# EAGLE design main (EAGLE 6.2)
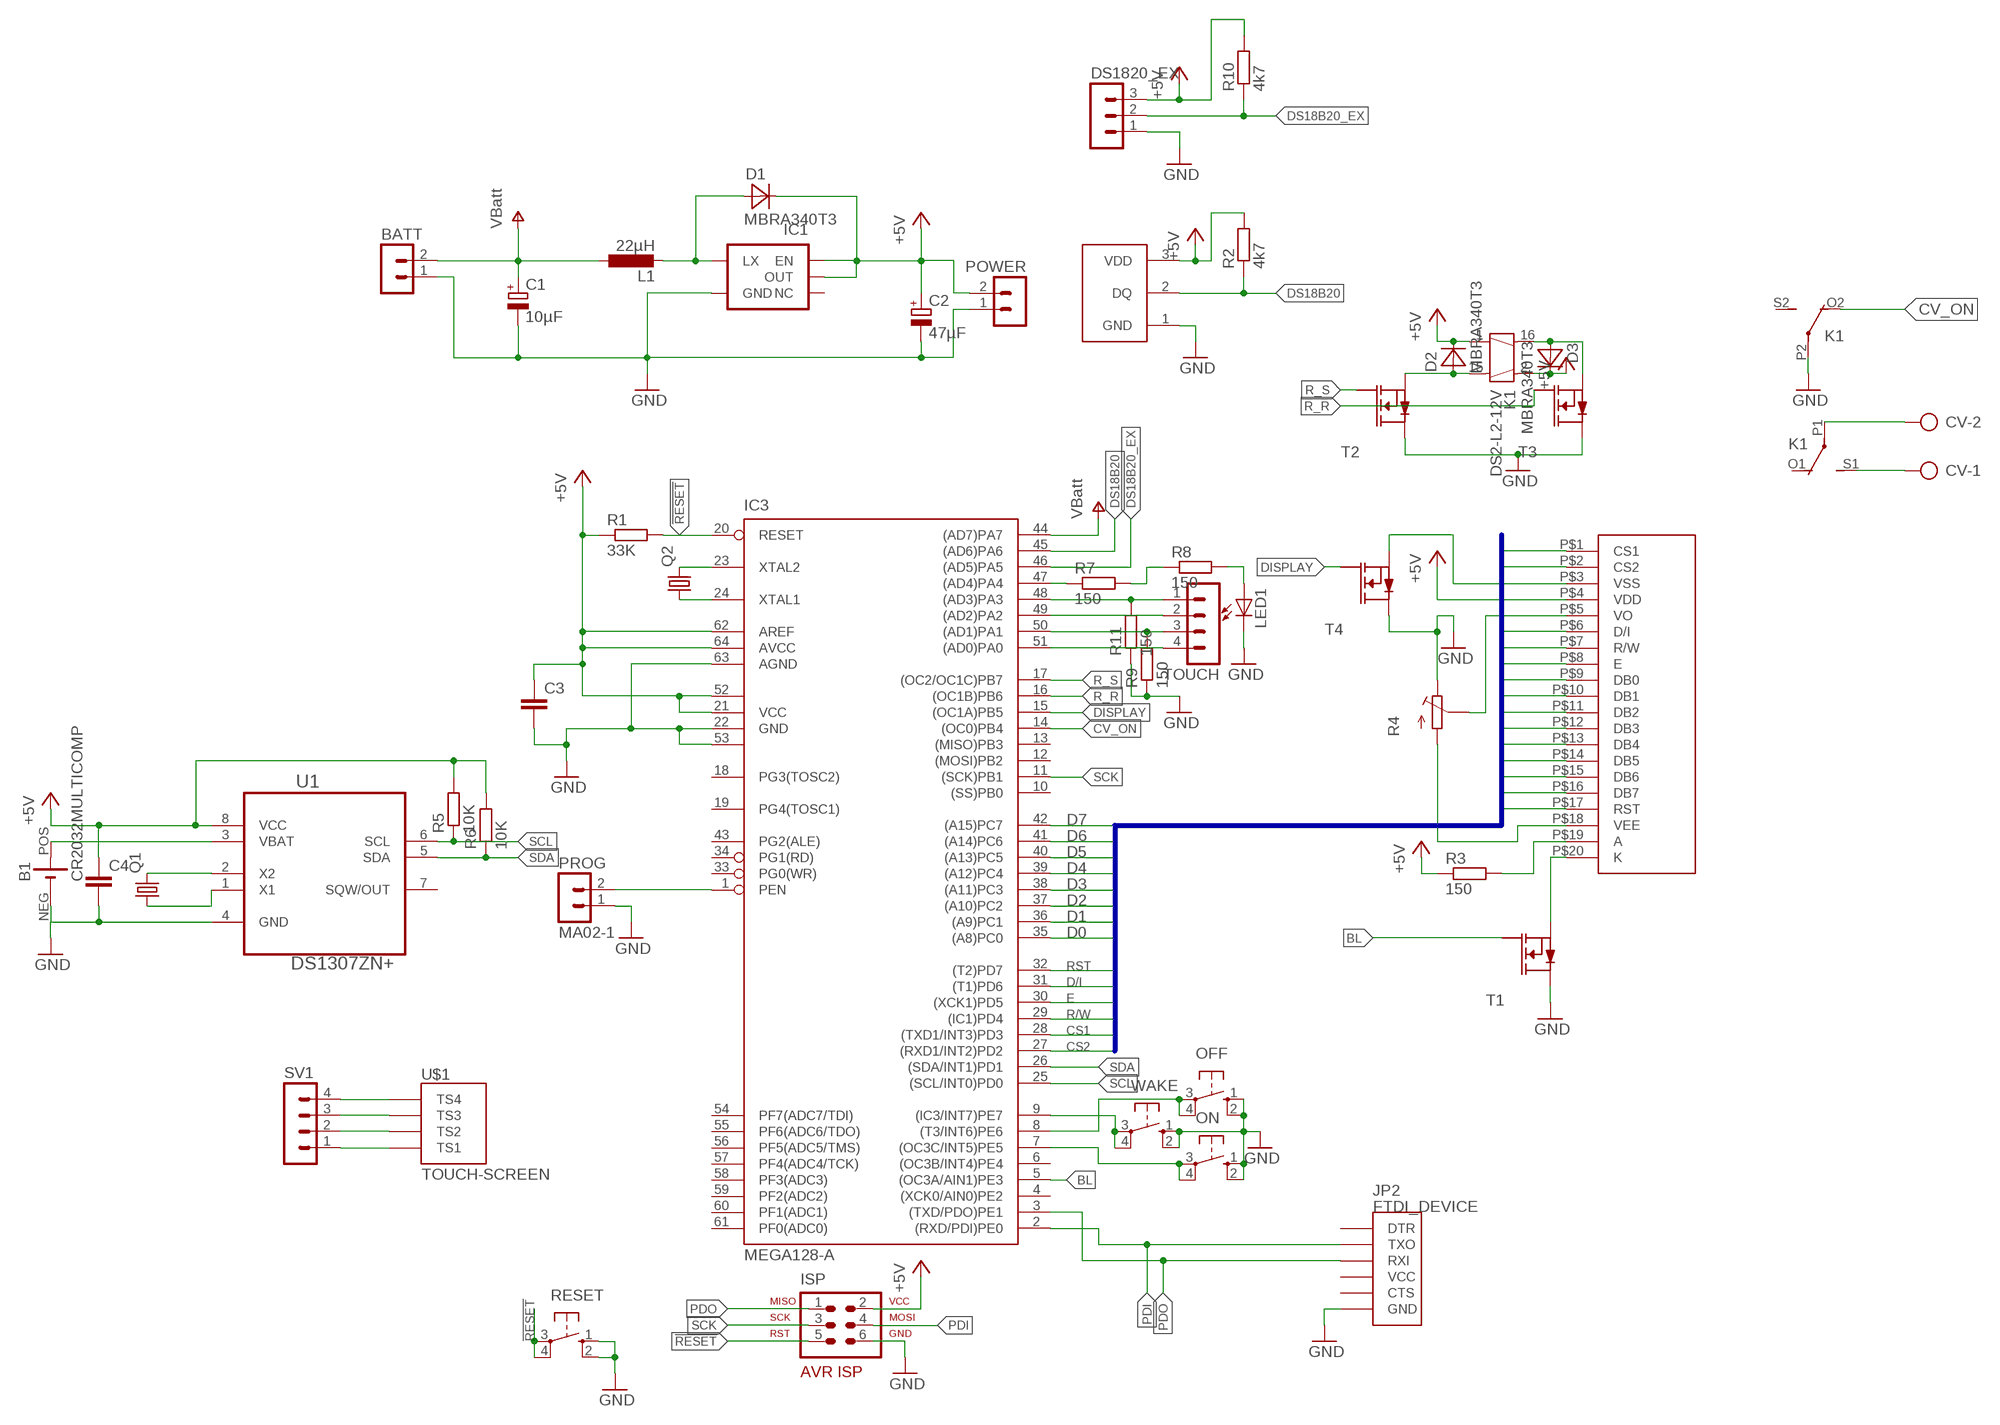
[diagram p0: schematic, sheet 1]

## Parts
B1  CR2032MULTICOMP  [CR2032]
BATT  MA02-1  [MA02-1]
C1  10µF  CPOL-EUD  [PANASONIC_D]
C2  47µF  CPOL-EUD  [PANASONIC_D]
C3  C-EUC0805  [C0805]
C4  C-EUC0805  [C0805]
CV  AK300/2  [AK300/2]
D1  MBRA340T3  [SMA]
D2  MBRA340T3  [SMA]
D3  MBRA340T3  [SMA]
DS1820  DS18B20  [TO92]
DS1820_EX  MA03-1  [MA03-1]
IC1  V_REG_NCP1400SOT23-5  [SOT23-5]
IC3  MEGA128-A  [TQFP64]
ISP  AVR-ISP-6HORZ  [AVR-ISP-6R]
JP2  FTDI_DEVICE  [FTDI_DEVICE_SIDE]
K1  DS2-L2-12V  [DS2E-L2]
L1  22µH  L-EUL2012C  [L2012C]
LED1  LEDSML1206  [SML1206]
OFF  10-XX  [B3F-10XX]
ON  10-XX  [B3F-10XX]
POWER  MA02-1  [MA02-1]
PROG  MA02-1  [MA02-1]
Q1  CRYSTALTC26V  [TC26V]
Q2  CRYSTALSM49  [SM49]
R1  33K  R-EU_R0805  [R0805]
R2  4k7  R-EU_R0805  [R0805]
R3  150  R-EU_R0805  [R0805]
R4  TRIM  [TRIM]
R5  10K  R-EU_R0805  [R0805]
R6  10K  R-EU_R0805  [R0805]
R7  150  R-EU_R0805  [R0805]
R8  150  R-EU_R0805  [R0805]
R9  150  R-EU_R0805  [R0805]
R10  4k7  R-EU_R0805  [R0805]
R11  150  R-EU_R0805  [R0805]
RESET  10-XX  [B3F-10XX]
SV1  MA04-1  [MA04-1]
T1  IRLML2502PBF  [SOT23]
T2  IRLML2502PBF  [SOT23]
T3  IRLML2502PBF  [SOT23]
T4  IRLML2502PBF  [SOT23]
TOUCH  MA04-1  [MA04-1]
U1  DS1307ZN+  [SOIC127P600X175-8N]
U$1  TOUCH-SCREEN  [TOUCH-SCREEN]
U$2  GLCD_LEDSEE  [GLCD_LEDSEE]
WAKE  10-XX  [B3F-10XX]

## Nets
!RESET: IC3.20(RESET) ISP.5 R1.2 RESET.3(P) RESET.4(P1)
+5V: C2.+ C3.1 C4.1 D1.C D2.C D3.C DS1820.3(VDD) DS1820_EX.3 IC1.1(EN) IC1.2(OUT) IC3.21(VCC) IC3.52(VCC1) IC3.62(AREF) IC3.64(AVCC) ISP.2 K1.1 K1.2 POWER.2 R1.1 R2.2 R3.1 R5.2 R6.2 R10.2 U1.8(VCC) U$2.P$4(VDD)
BL: IC3.5((OC3A/AIN1)PE3) T1.1(G)
CS1: IC3.28((TXD1/INT3)PD3) U$2.P$1(CS1)
CS2: IC3.27((RXD1/INT2)PD2) U$2.P$2(CS2)
CV_ON: IC3.14((OC0)PB4) K1.O2(3:O)
D0: IC3.35((A8)PC0) U$2.P$9(DB0)
D1: IC3.36((A9)PC1) U$2.P$10(DB1)
D2: IC3.37((A10)PC2) U$2.P$11(DB2)
D3: IC3.38((A11)PC3) U$2.P$12(DB3)
D4: IC3.39((A12)PC4) U$2.P$13(DB4)
D5: IC3.40((A13)PC5) U$2.P$14(DB5)
D6: IC3.41((A14)PC6) U$2.P$15(DB6)
D7: IC3.42((A15)PC7) U$2.P$16(DB7)
D/I: IC3.31((T1)PD6) U$2.P$6(D/I)
DISPLAY: IC3.15((OC1A)PB5) T4.1(G)
DS18B20: DS1820.2(DQ) IC3.45((AD6)PA6) R2.1
DS18B20_EX: DS1820_EX.2 IC3.46((AD5)PA5) R10.1
E: IC3.30((XCK1)PD5) U$2.P$8(E)
GND: B1.NEG(-) BATT.1 C1.- C2.- C3.2 C4.2 DS1820.1(GND) DS1820_EX.1 IC1.4(GND) IC3.22(GND) IC3.53(GND1) IC3.63(AGND) ISP.6 JP2.P$6(GND) K1.P2(3:P) LED1.C OFF.1(S) OFF.2(S1) ON.1(S) ON.2(S1) POWER.1 PROG.1 R4.1 R9.1 R11.1 RESET.1(S) RESET.2(S1) T1.3(D) T2.3(D) T3.3(D) T4.3(D) U1.4(GND) WAKE.1(S) WAKE.2(S1)
N$1: D1.A IC1.5(LX) L1.2
N$3: SV1.4 U$1.P$1(TS4)
N$4: SV1.3 U$1.P$2(TS3)
N$5: SV1.2 U$1.P$3(TS2)
N$6: SV1.1 U$1.P$4(TS1)
N$7: R3.2 U$2.P$19(A)
N$8: IC3.1(PEN) PROG.2
N$9: T1.2(S) U$2.P$20(K)
N$10: IC3.9((IC3/INT7)PE7) WAKE.3(P) WAKE.4(P1)
N$12: R4.3 U$2.P$18(VEE)
N$13: R4.2(T) U$2.P$5(VO)
N$14: D2.A K1.15 T2.2(S)
N$15: D3.A K1.16 T3.2(S)
N$16: IC3.8((T3/INT6)PE6) OFF.3(P) OFF.4(P1)
N$17: CV.2 K1.P1(2:P)
N$18: CV.1 K1.S1(2:S)
N$19: IC3.51((AD0)PA0) TOUCH.4
N$20: IC3.50((AD1)PA1) R9.2 TOUCH.3
N$21: IC3.49((AD2)PA2) TOUCH.2
N$22: IC3.48((AD3)PA3) R11.2 TOUCH.1
N$23: T4.2(S) U$2.P$3(VSS)
N$24: B1.POS(+) U1.3(VBAT)
N$26: Q1.1 U1.1(X1)
N$27: Q1.2 U1.2(X2)
N$28: IC3.7((OC3C/INT5)PE5) ON.3(P) ON.4(P1)
N$29: LED1.A R8.2
N$30: IC3.47((AD4)PA4) R7.1
N$31: R7.2 R8.1
N$33: IC3.23(XTAL2) Q2.2
N$34: IC3.24(XTAL1) Q2.1
PDI: IC3.2((RXD/PDI)PE0) ISP.4 JP2.P$2(TXO)
PDO: IC3.3((TXD/PDO)PE1) ISP.1 JP2.P$3(RXI)
R/W: IC3.29((IC1)PD4) U$2.P$7(R/W)
R_R: IC3.16((OC1B)PB6) T3.1(G)
R_S: IC3.17((OC2/OC1C)PB7) T2.1(G)
RST: IC3.32((T2)PD7) U$2.P$17(RST)
SCK: IC3.11((SCK)PB1) ISP.3
SCL: IC3.25((SCL/INT0)PD0) R5.1 U1.6(SCL)
SDA: IC3.26((SDA/INT1)PD1) R6.1 U1.5(SDA)
V+: BATT.2 C1.+ IC3.44((AD7)PA7) L1.1 ; supply symbol labelled VBatt
Unconnected: IC1.3(NC) IC3.4((XCK0/AIN0)PE2) IC3.6((OC3B/INT4)PE4) IC3.10((SS)PB0) IC3.12((MOSI)PB2) IC3.13((MISO)PB3) IC3.18(PG3(TOSC2)) IC3.19(PG4(TOSC1)) IC3.33(PG0(WR)) IC3.34(PG1(RD)) IC3.43(PG2(ALE)) IC3.54(PF7(ADC7/TDI)) IC3.55(PF6(ADC6/TDO)) IC3.56(PF5(ADC5/TMS)) IC3.57(PF4(ADC4/TCK)) IC3.58(PF3(ADC3)) IC3.59(PF2(ADC2)) IC3.60(PF1(ADC1)) IC3.61(PF0(ADC0)) JP2.P$1(DTR) JP2.P$4(VCC) JP2.P$5(CTS) K1.O1(2:O) K1.S2(3:S) U1.7(SQW/OUT)

## Buses
D[0..7],RST,D/I,E,R/W,CS1,CS2

## Library data of the parts
B1 = custom:CR2032; OC_FARNELL: 2064725
BATT POWER PROG = con-lstb:MA02-1
C1 C2 = rcl:CPOL-EU: POLARIZED CAPACITOR, European symbol
C3 C4 = rcl:C-EU: CAPACITOR, European symbol
CV = con-ptr500:AK300/2: CONNECTOR; OC_FARNELL: unknown; OC_NEWARK: unknown
D1-D3 = diode:MBRA340T3: Surface Mount Schottky Power Rectifier Source: http://www.onsemi.com/pub_link/Collateral/MBRA340T3-D.PDF
DS1820 = joep-custom:DS18B20
DS1820_EX = con-lstb:MA03-1: PIN HEADER; OC_FARNELL: unknown; OC_NEWARK: unknown
IC1 = SparkFun-PowerIC:V_REG_NCP1400: Switching step-up voltage regulator NCP1400 switiching regulator takes single cell AA and outputs 100mA at 3.3V or 5V with minimal number of external components.
IC3 = avr-7:MEGA128: MICROCONTROLLER 128 Kbytes FLASH 4 Kbytes SRAM 4 Kbytes EEPROM DUAL USART 8-channel 10 bit ADC
ISP = avr-7:AVR-ISP-6: AVR ISP-6 Serial Programming Header
JP2 = SparkFun-Connectors:FTDI_DEVICE: Connector which mates to FTDI basic or FTDI cable.
K1 = relay:DS2-L2-*: RELAY NAiS bistable, 2 x switch, 4 A/250 V; OC_FARNELL: unknown; OC_NEWARK: unknown
L1 = rcl:L-EU: INDUCTOR, European symbol
LED1 = led:LED: LED OSRAM: - CHIPLED LG R971, LG N971, LY N971, LG Q971, LY Q971, LO R971, LY R971 LH N974, LH R974 LS Q976, LO Q976, LY Q976 LO Q996 - Hyper CHIPLED LW Q18S LB Q993, LB Q99A, LB R99A - SideLED LS A670, LO A670, LY A670, LG A670, LP A670 LB A673, LV A673, LT A673, LW A673 LH A674 LY A675 LS A676, LA A676, LO A676, LY A676, LW A676 LS A679, LY A679, LG A679 - Hyper Micro SIDELED® LS Y876, LA Y876, LO Y876, LY Y876 LT Y87S - SmartLED LW L88C, LW L88S LB L89C, LB L89S, LG L890 LS L89K, LO L89K, LY L89K LS L896, LA L896, LO L896, LY L896 - TOPLED LS T670, LO T670, LY T670, LG T670, LP T670 LSG T670, LSP T670, LSY T670, LOP T670, LYG T670 LG T671, LOG T671, LSG T671 LB T673, LV T673, LT T673, LW T673 LH T674 LS T676, LA T676, LO T676, LY T676, LB T676, LH T676, LSB T676, LW T676 LB T67C, LV T67C, LT T67C, LS T67K, LO T67K, LY T67K, LW E67C LS E67B, LA E67B, LO E67B, LY E67B, LB E67C, LV E67C, LT E67C LW T67C LS T679, LY T679, LG T679 LS T770, LO T770, LY T770, LG T770, LP T770 LB T773, LV T773, LT T773, LW T773 LH T774 LS E675, LA E675, LY E675, LS T675 LS T776, LA T776, LO T776, LY T776, LB T776 LHGB T686 LT T68C, LB T68C - Hyper Mini TOPLED® LB M676 - Mini TOPLED Santana® LG M470 LS M47K, LO M47K, LY M47K Source: http://www.osram.convergy.de LUXEON: - LUMILED® LXK2-PW12-R00, LXK2-PW12-S00, LXK2-PW14-U00, LXK2-PW14-V00 LXK2-PM12-R00, LXK2-PM12-S00, LXK2-PM14-U00 LXK2-PE12-Q00, LXK2-PE12-R00, LXK2-PE12-S00, LXK2-PE14-T00, LXK2-PE14-U00 LXK2-PB12-K00, LXK2-PB12-L00, LXK2-PB12-M00, LXK2-PB14-N00, LXK2-PB14-P00, LXK2-PB14-Q00 LXK2-PR12-L00, LXK2-PR12-M00, LXK2-PR14-Q00, LXK2-PR14-R00 LXK2-PD12-Q00, LXK2-PD12-R00, LXK2-PD12-S00 LXK2-PH12-R00, LXK2-PH12-S00 LXK2-PL12-P00, LXK2-PL12-Q00, LXK2-PL12-R00 Source: www.luxeon.com KINGBRIGHT: KA-3528ASYC Source: www.kingbright.com
OFF ON RESET WAKE = switch-omron:10-XX: OMRON SWITCH; MPN: B3F-1000; OC_FARNELL: 176432; OC_NEWARK: 36M3542
Q1 Q2 = crystal:CRYSTAL: CRYSTAL; OC_FARNELL: unknown; OC_NEWARK: unknown
R1-R3 R5-R11 = rcl:R-EU_: RESISTOR, European symbol
R4 = custom:TRIM
SV1 TOUCH = con-lstb:MA04-1: PIN HEADER; OC_FARNELL: unknown; OC_NEWARK: unknown
T1-T4 = custom:IRLML2502PBF; OC_FARNELL: 9102981
U1 = custom:DS1307ZN+: 64 x 8, Serial, I2C Real-Time Clock; MPN: DS1307ZN+; OC_FARNELL: 9725253; OC_NEWARK: 73J0081; PACKAGE: SOIC-8; SUPPLIER: Maxim
U$1 = SparkFun-Connectors:TOUCH-SCREEN: Nintendo DS touch screen connector LCD-09105
U$2 = SparkFun-Displays:GLCD_LEDSEE

## Board
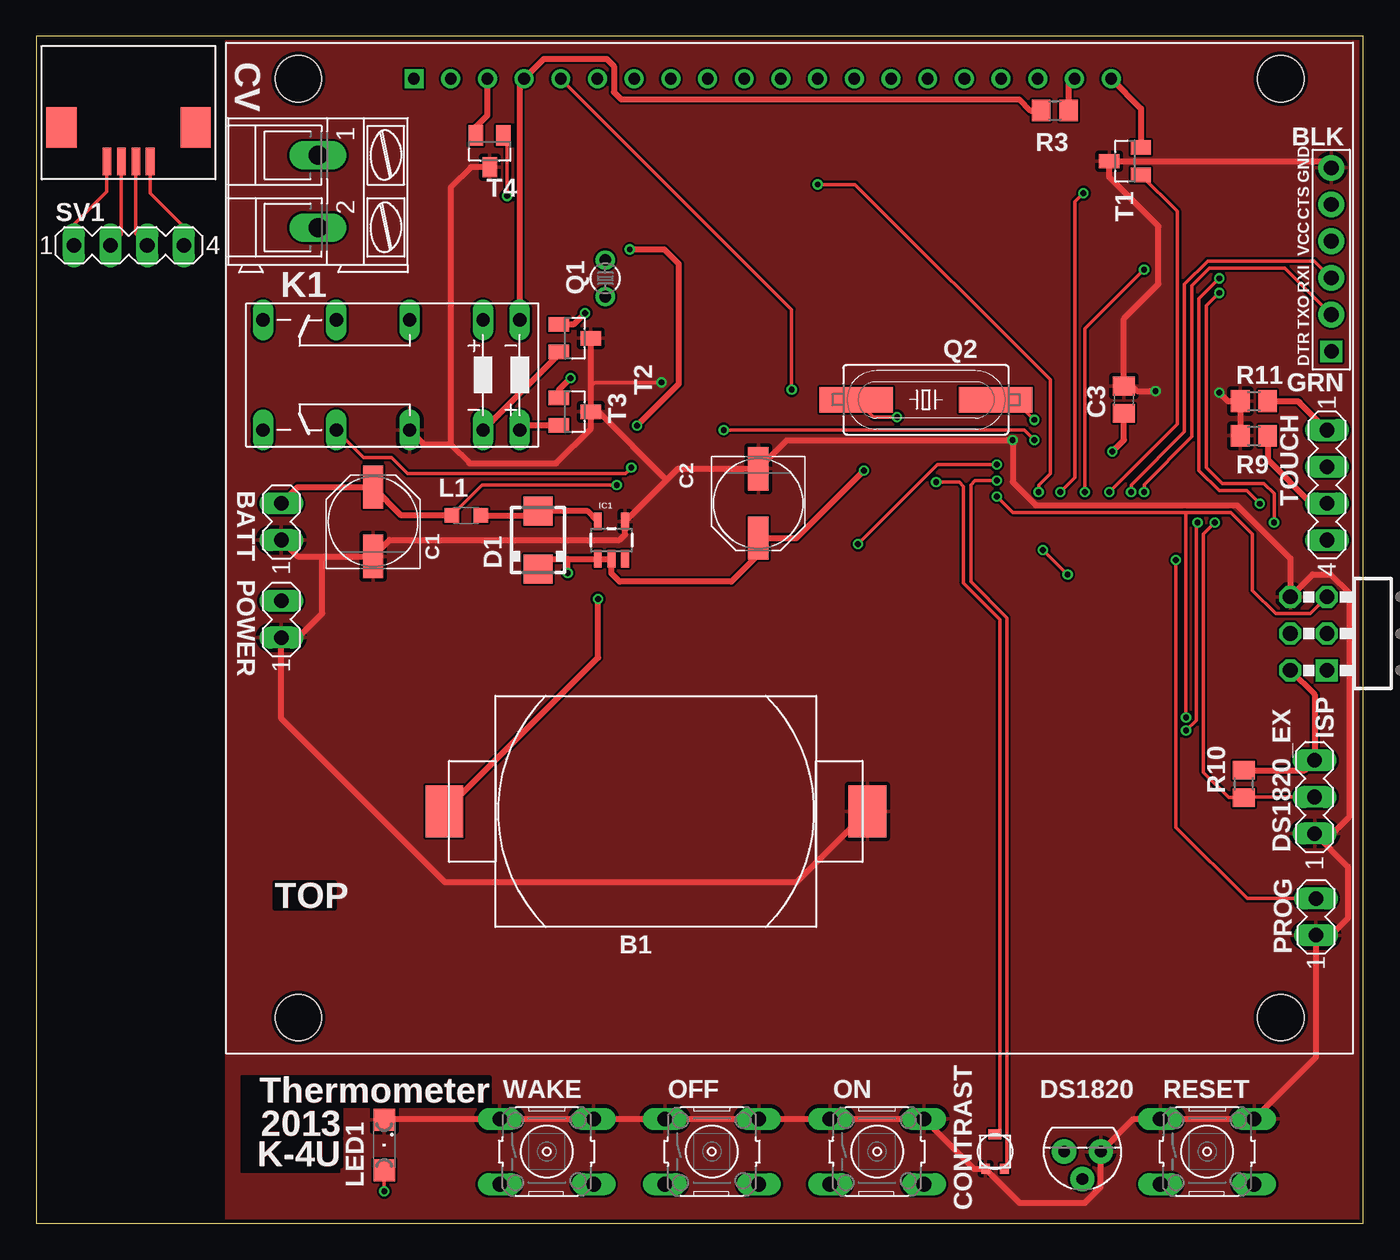
[diagram p1: board, top side]
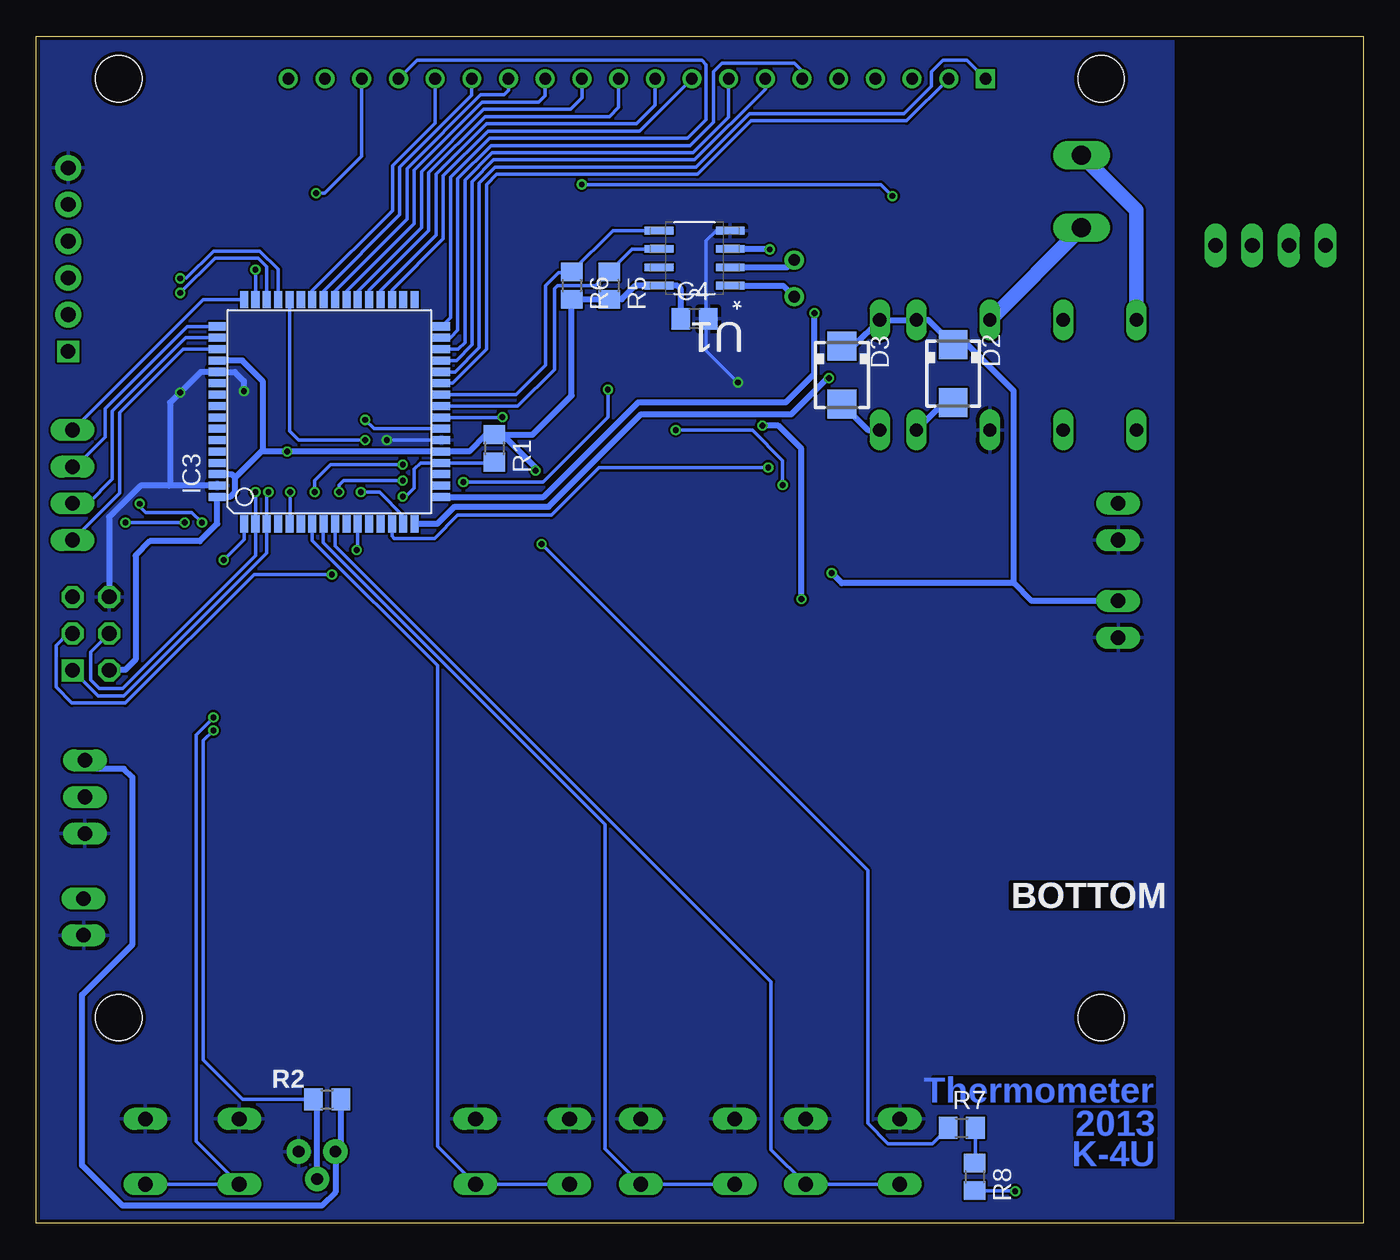
[diagram p2: board, bottom side, seen from below]

Size 91.88 x 82.2 mm. Coordinates in mm from the lower left corner, seen from the top.
Outline: 0,0 91.88,0 91.88,82.2 0,82.2 0,0
Copper layers (1*16): Top 0.035mm / dielectric 1.5mm / Bottom 0.035mm
Design rules: minimum track width 6mil, minimum drill 12mil, track to track 6mil, track to pad 6mil, pad to pad 6mil, via to via 6mil, smd to smd 0mil, copper to edge 10mil, drill to drill 10mil, minimum pad ring 10mil, minimum via ring 6mil, stop-mask expansion 2mil, vias tented up to drill 100mil, thermal gap 10mil

### Footprints (pad centres in the part's own frame; a part is rotated, then mirrored left to right if it is on the bottom)
CR2032 = smd 2.6 x 3.6: NEG -14.65,0; POS 14.65,0
MA02-1 = drill 1.016 long: 1 -1.27,0; 2 1.27,0
PANASONIC_D = smd 3 x 1.4: + 2.4,0; - -2.4,0
C0805 = smd 1.3 x 1.5: 1 -0.95,0; 2 0.95,0
AK300/2 = drill 1.321 long: 1 -2.515,0; 2 2.489,0
SMA = smd 2 x 2: A 2,0; C -2,0
TO92 = drill 0.813 pad 1.676: 1 -1.27,0; 2 0,1.905; 3 1.27,0
MA03-1 = drill 1.016 long: 1 -2.54,0; 2 0,0; 3 2.54,0
SOT23-5 = smd 0.55 x 1.2: 1 -0.95,-1.3; 2 0,-1.3; 3 0.95,-1.3; 4 0.95,1.3; 5 -0.95,1.3
TQFP64 = smd 1.194 x 0.559: 1 -7.76,5.905; 2 -7.76,5.118; 3 -7.76,4.331; 4 -7.76,3.543; 5 -7.76,2.756; 6 -7.76,1.968; 7 -7.76,1.181; 8 -7.76,0.394; 9 -7.76,-0.394; 10 -7.76,-1.181; 11 -7.76,-1.968; 12 -7.76,-2.756; 13 -7.76,-3.543; 14 -7.76,-4.331; 15 -7.76,-5.118; 16 -7.76,-5.905; 33 7.76,-5.905; 34 7.76,-5.118; 35 7.76,-4.331; 36 7.76,-3.543; 37 7.76,-2.756; 38 7.76,-1.968; 39 7.76,-1.181; 40 7.76,-0.394; 41 7.76,0.394; 42 7.76,1.181; 43 7.76,1.968; 44 7.76,2.756; 45 7.76,3.543; 46 7.76,4.331; 47 7.76,5.118; 48 7.76,5.905 | smd 0.559 x 1.194: 17 -5.905,-7.76; 18 -5.118,-7.76; 19 -4.331,-7.76; 20 -3.543,-7.76; 21 -2.756,-7.76; 22 -1.968,-7.76; 23 -1.181,-7.76; 24 -0.394,-7.76; 25 0.394,-7.76; 26 1.181,-7.76; 27 1.968,-7.76; 28 2.756,-7.76; 29 3.543,-7.76; 30 4.331,-7.76; 31 5.118,-7.76; 32 5.905,-7.76; 49 5.905,7.76; 50 5.118,7.76; 51 4.331,7.76; 52 3.543,7.76; 53 2.756,7.76; 54 1.968,7.76; 55 1.181,7.76; 56 0.394,7.76; 57 -0.394,7.76; 58 -1.181,7.76; 59 -1.968,7.76; 60 -2.756,7.76; 61 -3.543,7.76; 62 -4.331,7.76; 63 -5.118,7.76; 64 -5.905,7.76
AVR-ISP-6R = drill 1.016 square: 1 -2.54,-1.27 | drill 1.016 octagon: 2 -2.54,1.27; 3 0,-1.27; 4 0,1.27; 5 2.54,-1.27; 6 2.54,1.27
FTDI_DEVICE_SIDE = drill 1 square: P$1 -6.35,0 | drill 1.016 pad 1.778: P$2 -3.81,0; P$3 -1.27,0; P$4 1.27,0; P$5 3.81,0; P$6 6.35,0
DS2E-L2 = drill 0.914 long: 1 -7.62,-3.81; 2 -5.08,-3.81; 15 -5.08,3.81; 16 -7.62,3.81; O1 5.08,-3.81; O2 5.08,3.81; P1 0,-3.81; P2 0,3.81; S1 10.16,-3.81; S2 10.16,3.81
L2012C = smd 1 x 1: 1 -1,0; 2 1,0
SML1206 = smd 1.5 x 1.5: A 1.75,0; C -1.75,0
B3F-10XX = drill 1.016 long: 1 -3.251,2.261; 2 3.251,2.261; 3 -3.251,-2.261; 4 3.251,-2.261
TC26V = drill 0.813: 1 -1.27,0; 2 1.27,0
SM49 = smd 5.08 x 1.778: 1 -4.826,0; 2 4.826,0
R0805 = smd 1.3 x 1.5: 1 -0.95,0; 2 0.95,0
TRIM = smd 0.6 x 0.7: 1 -0.65,-1.2; 3 0.65,-1.2 | smd 0.9 x 0.7: 2 0,1.2
MA04-1 = drill 1.016 long: 1 -3.81,0; 2 -1.27,0; 3 1.27,0; 4 3.81,0
SOT23 = smd 1 x 1.4: 1 -0.95,-1.1; 2 0.95,-1.1; 3 0,1.1
SOIC127P600X175-8N = smd 1.981 x 0.533: 1 -2.464,1.905; 2 -2.464,0.635; 3 -2.464,-0.635; 4 -2.464,-1.905; 5 2.464,-1.905; 6 2.464,-0.635; 7 2.464,0.635; 8 2.464,1.905
TOUCH-SCREEN = smd 0.6 x 1.9: P$1 0,0; P$2 1,0; P$3 2,0; P$4 3,0 | smd 2.1 x 2.8: P$5 -3.15,-2.35; P$6 6.15,-2.35
GLCD_LEDSEE = drill 0.8 square: P$1 13,67.5 | drill 0.8: P$2 15.54,67.5; P$3 18.08,67.5; P$4 20.62,67.5; P$5 23.16,67.5; P$6 25.7,67.5; P$7 28.24,67.5; P$8 30.78,67.5; P$9 33.32,67.5; P$10 35.86,67.5; P$11 38.4,67.5; P$12 40.94,67.5; P$13 43.48,67.5; P$14 46.02,67.5; P$15 48.56,67.5; P$16 51.1,67.5; P$17 53.64,67.5; P$18 56.18,67.5; P$19 58.72,67.5; P$20 61.26,67.5 | hole 3.2: 5,67.5; 73,67.5; 73,2.5; 5,2.5

### Placement (x,y rotation side)
B1  42.9,28.53 180 top
BATT  16.97,48.58 90 top
C1  23.32,48.58 90 top
C2  49.99,49.85 270 top
C3  75.3,57.03 90 top
C4  46.3,62.63 0 bottom
CV  19.51,71.44 270 top
D1  34.75,47.31 90 top
D2  28.4,58.83 270 bottom
D3  36.1,58.73 270 bottom
DS1820  72.43,4.98 180 top
DS1820_EX  88.5,29.53 90 top
IC1  39.83,47.31 0 top
IC3  71.58,56.2 90 bottom
ISP  88.09,40.84 90 top
JP2  89.66,66.73 90 top
K1  25.86,58.74 180 top
L1  29.77,49.02 0 top
LED1  24.1,5.43 270 top
OFF  46.78,4.98 0 top
ON  58.21,4.98 0 top
POWER  16.97,41.83 90 top
PROG  88.6,21.23 90 top
Q1  39.4,65.43 90 top
Q2  61.6,57.03 0 top
R1  60.15,53.66 270 bottom
R2  71.73,8.6 0 bottom
R3  70.52,77.05 0 top
R4  66.38,4.98 0 top
R5  52.2,64.93 270 bottom
R6  54.8,64.93 270 bottom
R7  27.8,6.63 0 bottom
R8  26.9,3.23 270 bottom
R9  84.3,54.53 0 top
R10  83.6,30.43 90 top
R11  84.3,56.93 0 top
RESET  81.07,4.98 0 top
SV1  6.42,67.72 0 top
T1  75.38,73.54 90 top
T2  37.29,61.28 270 top
T3  37.29,56.2 270 top
T4  31.4,74.23 180 top
TOUCH  89.36,51.12 270 top
U1  46.3,66.83 180 bottom
U$1  7.9,73.53 180 top
U$2  13.16,11.75 0 top
WAKE  35.35,4.98 0 top

### Tracks (layer width: path | path; a pad name or v marks a point on that pad's centre or on a via)
!RESET  (via drill 0.4)
  Top 0.254: ISP.5 88.21,42.23 85.8,42.23 84.2,43.83 84.2,47.73 82.7,49.23 79.5,49.23 | 79.5,49.23 67.6,49.23 v66.5,50.33 | v79.6,35.03 79.6,49.13 79.5,49.23
  Bottom 0.254: R1.2 60.2,52.66 IC3.20 65.27,52.66 65.7,52.23 65.7,50.93 66.3,50.33 v66.5,50.33 | RESET.4 RESET.3 80.8,5.7 80.8,33.83 v79.6,35.03
+5V  (via drill 0.4)
  Top 0.406: D1.C 35.45,46.01 36.8,46.01 | 36.8,46.01 IC1.1 IC1.2 39.83,45 40.4,44.43 48.12,44.43 49.99,46.3 C2.+ 52.62,47.45 v57.3,52.13 | K1.1 33.48,78.95 U$2.P$4 35.16,80.63 39.5,80.63 40,80.13 40,78.33 40.5,77.83 68.05,77.83 68.83,77.05 R3.1 | v74.5,53.44 75.3,54.24 C3.1 | ISP.2 88.5,36.62 DS1820_EX.3 87.81,31.38 R10.2 | v36.8,45.03 36.8,46.01
  Bottom 0.254: 79.3,50.33 IC3.64
  Bottom 0.406: R1.1 59.58,54.61 57.3,52.33 v57.3,52.13 | R1.1 60.72,54.61 61.89,53.44 IC3.21 v74.5,53.44 76.2,53.44 | 76.2,53.44 76.29,53.44 78.1,51.63 | IC3.62 78.34,51.87 78.1,51.63 | 79.3,50.33 78.4,50.33 78.1,50.63 78.1,51.63 | IC3.64 79.34,48.44 80.55,47.23 84,47.23 85,46.23 85,39.03 85.7,38.33 86.79,38.33 ISP.2 | 76.2,53.44 76.2,58.33 77.61,59.74 IC3.52 | R1.1 57.52,54.61 54.8,57.33 R6.2 R5.2 51.35,63.98 50.41,64.92 U1.8 47.49,64.92 47.25,64.68 C4.1 | D3.C 35.3,60.73 K1.1 K1.2 30.12,62.55 D2.C 27.4,60.83 24.2,57.63 24.2,44.33 | R2.2 70.78,5.36 DS1820.3 71.16,2.17 72.1,1.23 85.9,1.23 88.7,4.03 88.7,15.83 85.2,19.33 85.2,30.88 85.8,31.48 87.91,31.48 DS1820_EX.3 | POWER.2 22.97,43.1 24.2,44.33 | 24.2,44.33 36.1,44.33 v36.8,45.03
BL  (via drill 0.4)
  Top 0.254: T1.1 79,70.07 79,55.33 v74.3,50.63
  Bottom 0.254: v74.3,50.63 74.3,48.48 IC3.5
CS1
  Bottom 0.254: U$2.P$1 27.44,80.53 29.1,80.53 29.9,79.73 29.9,78.73 31.8,76.83 42.5,76.83 46.2,73.13 60.1,73.13 61.2,72.03 61.2,60.63 62.87,58.96 IC3.28
CS2
  Bottom 0.254: IC3.27 63.06,58.17 60.7,60.53 60.7,71.93 60,72.63 46.1,72.63 42.4,76.33 31.62,76.33 U$2.P$2
CV_ON  (via drill 0.4)
  Top 0.254: v41.2,52.33 40.8,51.93 25.7,51.93 24.6,53.03 22.68,53.03 K1.O2
  Bottom 0.254: IC3.14 67.25,47.58 67.1,47.43 64.3,47.43 62.7,49.03 56.2,49.03 52.9,52.33 v41.2,52.33
D0
  Bottom 0.254: IC3.35 67.25,64.63 63.7,68.18 63.7,72.53 60.6,75.63 50.1,75.63 U$2.P$9
D1
  Bottom 0.254: U$2.P$10 49.02,77.41 50.3,76.13 60.7,76.13 64.2,72.63 64.2,68.43 68.04,64.59 IC3.36
D2
  Bottom 0.254: U$2.P$11 51.56,77.27 52.2,76.63 60.8,76.63 64.7,72.73 64.7,68.73 68.82,64.61 IC3.37
D3
  Bottom 0.254: U$2.P$12 54.1,77.93 54.9,77.13 60.9,77.13 65.2,72.83 65.2,68.93 69.61,64.52 IC3.38 69.61,64.42
D4
  Bottom 0.254: U$2.P$13 56.64,78.09 57.1,77.63 61,77.63 65.7,72.93 65.7,69.23 70.4,64.53 IC3.39
D5
  Bottom 0.254: U$2.P$14 59.18,78.45 59.5,78.13 61.1,78.13 66.2,73.03 66.2,69.53 71.19,64.54 IC3.40
D6
  Bottom 0.254: 61.72,78.81 U$2.P$15 61.72,78.11 66.7,73.13 66.7,69.83 71.97,64.56 IC3.41
D7
  Bottom 0.254: U$2.P$16 64.26,76.17 67.2,73.23 67.2,70.13 72.76,64.57 IC3.42
D/I
  Bottom 0.254: IC3.31 63.2,61.32 63.2,61.33 62.7,61.83 62.7,72.33 60.4,74.63 46.6,74.63 45,76.23 45,79.73 44.4,80.33 39.4,80.33 38.86,79.79 U$2.P$6
DISPLAY  (via drill 0.4)
  Top 0.254: v69.4,50.63 69.4,51.13 70.2,51.93 70.2,58.43 56.7,71.93 v54.1,71.93 | T4.1 32.6,75.08 v32.6,71.13
  Bottom 0.254: v54.1,71.93 33.4,71.93 v32.6,71.13 | IC3.15 66.46,48.99 68.1,50.63 v69.4,50.63
DS18B20  (via drill 0.4)
  Top 0.254: v80.4,48.53 80.3,48.43 80.3,34.83 v79.6,34.13 | v84.7,49.83 83.8,50.73 81.9,50.73 80.5,52.13 80.5,64.03 v81.9,65.43
  Bottom 0.254: IC3.45 75.12,66.05 76.4,67.33 79.6,67.33 81.5,65.43 v81.9,65.43 | v80.4,48.53 81.1,49.23 84.3,49.23 84.7,49.63 v84.7,49.83 | R2.1 77.57,8.6 80.3,11.33 80.3,33.43 v79.6,34.13
  Bottom 0.406: DS1820.2 72.43,8.35 R2.1
DS18B20_EX  (via drill 0.4)
  Top 0.254: v81.6,48.53 80.8,47.73 80.8,31.23 82.55,29.48 R10.1 83.65,29.53 DS1820_EX.2 | v81.9,64.43 81,63.53 81,52.33 82.1,51.23 85,51.23 85.7,50.53 v85.7,48.53
  Bottom 0.254: IC3.46 75.91,66.24 76.5,66.83 79.5,66.83 v81.9,64.43 | v81.6,48.53 v85.7,48.53
E
  Bottom 0.254: IC3.30 62.66,60.53 62.2,60.99 62.2,72.23 60.3,74.13 46.4,74.13 43.94,76.59 U$2.P$8
GND  (via drill 0.4)
  Top 0.254: v43.3,58.23 38.69,58.23 38.39,57.93 | C3.2 75.85,57.98
  Top 0.406: BATT.1 18.1,46.18 20,46.18 | 20,46.18 C1.- 24.47,47.33 40.4,47.33 40.78,47.71 IC1.4 43.65,51.48 | T2.3 38.39,57.93 T3.3 38.93,56.2 43.65,51.48 | 28.7,53.93 30,52.63 36,52.63 38.4,55.03 38.4,56.23 | 50.1,52.23 50.1,53.29 | 75.85,57.98 76.2,57.63 v77.5,57.63 | LED1.C 24.16,7.24 WAKE.1 WAKE.2 OFF.1 OFF.2 ON.1 ON.2 64.92,3.78 R4.1 68.08,1.43 72.6,1.43 73.7,2.53 DS1820.1 75.96,7.24 RESET.1 RESET.2 88.6,11.52 PROG.1 89.63,19.96 90.8,21.13 90.8,24.69 DS1820_EX.1 88.54,27.03 89.8,27.03 90.9,28.13 90.9,43.63 89.6,44.93 88.37,44.93 ISP.6 86.82,46.04 83.13,49.73 69.2,49.73 67.6,51.33 v67.6,54.23 51.97,54.23 C2.- 44.42,52.25 43.65,51.48 | 20,46.18 19.8,45.98 19.8,42.23 18.13,40.56 POWER.1 16.97,34.96 28.3,23.63 52.65,23.63 B1.NEG | T1.3 89.2,73.54 JP2.P$6 | T4.3 30.1,73.13 28.7,71.73 28.7,53.93 | T1.3 | C3.2 75.3,62.63 77.7,65.03 77.7,69.03 74.28,72.45 T1.3 | 28.7,53.93 26.86,53.93 K1.P2 | v81.9,57.53 82.5,56.93 R11.1 R9.1
  Bottom 0.254: IC3.22 v67.6,54.23 | U1.4 44.8,68.73 45.5,68.03 45.5,62.48 | v43.3,58.23 45.5,60.43 45.5,62.48 | 45.5,62.48 C4.2
  Bottom 0.406: v77.5,57.63 77.5,58.33 78.13,58.96 IC3.53 80.47,58.96 v81.9,57.53 82.6,56.83 82.6,51.18 82.7,51.08 | ISP.6 86.82,48.91 84.65,51.08 82.7,51.08 | IC3.63 82.7,51.08
  pour Top: 91.8,0 13.2,0 13.2,82.2 91.8,82.2
  pour Bottom: 91.8,0 13.2,0 13.2,82.2 91.8,82.2
N$1
  Top 0.406: IC1.5 38.18,49.31 D1.A 34.46,49.02 L1.2
N$3
  Top 0.254: U$1.P$1 7.9,71.33 10.23,69 SV1.4
N$4
  Top 0.254: U$1.P$2 6.9,68.51 SV1.3
N$5
  Top 0.254: SV1.2 5.9,68.47 U$1.P$3
N$6
  Top 0.254: SV1.1 2.61,69.14 4.9,71.43 U$1.P$4
N$7
  Top 0.406: U$2.P$19 71.47,78.84 R3.2
N$8  (via drill 0.4)
  Top 0.254: PROG.2 83.83,22.5 78.9,27.43 v78.9,45.93
  Bottom 0.254: IC3.1 77.49,47.34 v78.9,45.93
N$9
  Top 0.406: U$2.P$20 76.48,77.19 T1.2
N$10
  Bottom 0.254: WAKE.3 WAKE.4 41,5.12 41,16.73 71.19,46.92 IC3.9
N$12  (via drill 0.4)
  Top 0.254: v66.5,51.43 65,51.43 64.7,51.13 64.7,44.43 67.2,41.93 67.2,3.95 R4.3 | v72.5,71.33 71.9,70.73 71.9,51.63 v70.9,50.63
  Bottom 0.254: v66.5,51.43 70.6,51.43 70.9,51.13 v70.9,50.63 | U$2.P$18 69.34,73.89 71.9,71.33 v72.5,71.33
N$13  (via drill 0.4)
  Top 0.254: U$2.P$5 52.3,63.27 v52.3,57.73 | R4.2 66.7,6.5 66.7,41.83 64.2,44.33 64.2,51.03 63.9,51.33 v62.3,51.33
  Bottom 0.254: v62.3,51.33 56.8,51.33 52.3,55.83 v52.3,57.73
N$14
  Top 0.406: T2.2 36.19,60.18 K1.15
  Bottom 0.406: D2.A 29.04,56.83 K1.15
N$15
  Top 0.406: T3.2 33.8,55.25 K1.16
  Bottom 0.406: D3.A 34.3,54.93 K1.16
N$16
  Bottom 0.254: OFF.3 OFF.4 52.5,5.19 52.5,27.63 72,47.13 72,48.41 IC3.8
N$17
  Bottom 1.016: CV.2 19.51,68.9 K1.P1
N$18
  Bottom 1.016: CV.1 15.7,70.14 K1.S1
N$19
  Bottom 0.254: IC3.51 81.7,60.53 86.1,56.13 86.1,50.57 TOUCH.4
N$20
  Top 0.406: TOUCH.3 88.28,49.85 85.25,52.88 R9.2
  Bottom 0.254: IC3.50 81.51,61.32 86.6,56.23 86.6,51.53 88.28,49.85 TOUCH.3
N$21
  Bottom 0.254: IC3.49 81.42,62.11 87.1,56.43 87.1,54.43 89.14,52.39 TOUCH.2
N$22
  Top 0.406: TOUCH.1 87.48,56.81 87.36,56.93 R11.2
  Bottom 0.254: TOUCH.1 80.33,63.96 IC3.48
N$23
  Top 0.406: U$2.P$3 31.24,76.72 30.45,75.93 T4.2
N$24  (via drill 0.4)
  Top 0.406: v41.6,55.23 44.5,58.13 44.5,66.43 43.5,67.43 v41.1,67.43 | B1.POS 38.9,39.18 v38.9,43.23
  Bottom 0.406: v38.9,43.23 38.9,53.63 40.5,55.23 v41.6,55.23 | v41.1,67.43 41.13,67.47 U1.3
N$26
  Bottom 0.406: U1.1 40.16,64.92 Q1.1
N$27
  Bottom 0.406: U1.2 39.91,66.19 Q1.2
N$28
  Bottom 0.254: ON.3 ON.4 64.1,5.36 64.1,38.63 72.76,47.29 IC3.7
N$29  (via drill 0.4)
  Top 0.254: LED1.A v24.1,2.23
  Bottom 0.254: v24.1,2.23 24.15,2.28 R8.2
N$30  (via drill 0.4)
  Top 0.254: v56.9,47.03 62.4,52.53 v66.5,52.53 | v76.7,66.03 72.6,61.93 v72.6,50.63
  Bottom 0.254: R7.1 29.85,5.53 32.9,5.53 34.3,6.93 34.3,24.43 v56.9,47.03 | v76.7,66.03 IC3.47 | v66.5,52.53 71.5,52.53 72.6,51.43 v72.6,50.63
N$31
  Bottom 0.254: R8.1 26.85,4.23 R7.2
N$32
  cutout Top: 21,3.53 21,8.03 31.4,8.03 31.4,10.23 14.2,10.23 14.2,3.53
N$33  (via drill 0.4)
  Top 0.254: Q2.2 67.7,57.03 v69.1,55.63
  Bottom 0.254: v69.1,55.63 68.49,55.02 IC3.23
N$34  (via drill 0.4)
  Top 0.254: Q2.1 57.97,55.83 v59.6,55.83
  Bottom 0.254: v59.6,55.83 59.62,55.81 IC3.24
PDI  (via drill 0.4)
  Top 0.254: v76.7,50.63 76.7,51.16 80,54.46 80,64.93 81.2,66.13 86.45,66.13 JP2.P$2
  Bottom 0.254: v76.7,50.63 IC3.2 76.7,46.23 85.9,37.03 87.5,37.03 88.1,37.63 88.1,39.56 ISP.4
PDO  (via drill 0.4)
  Top 0.254: v75.8,50.63 75.8,51.13 79.5,54.83 79.5,65.03 81.1,66.63 88.49,66.63 JP2.P$3
  Bottom 0.254: IC3.3 | IC3.3 75.91,50.52 v75.8,50.63 | ISP.1 87.59,36.53 85.8,36.53 75.91,46.42 IC3.3
R/W
  Bottom 0.254: IC3.29 62.79,59.74 61.7,60.83 61.7,72.13 60.2,73.63 46.3,73.63 41.4,78.53 U$2.P$7
R_R  (via drill 0.4)
  Top 0.406: T3.1 36.19,57.72 v37,58.53
  Bottom 0.406: v37,58.53 37.1,58.53 39.6,56.03 50,56.03 56.4,49.63 62.9,49.63 64.09,48.44 IC3.16
R_S  (via drill 0.4)
  Top 0.406: v38,63.03 37.2,62.23 T2.1
  Bottom 0.406: IC3.17 56.74,50.29 50.2,56.83 40,56.83 38,58.83 v38,63.03
RST
  Bottom 0.254: U$2.P$17 65.52,80.53 45.8,80.53 45.5,80.23 45.5,76.43 46.8,75.13 60.5,75.13 63.2,72.43 63.2,62.73 IC3.32
SCK  (via drill 0.4)
  Top 0.254: v69.7,46.63 v71.4,44.93
  Bottom 0.254: IC3.11 69.61,46.72 v69.7,46.63 | v71.4,44.93 76.8,44.93 85.7,36.03 89.4,36.03 90.5,37.13 90.5,40.03 89.69,40.84 ISP.3
SCL
  Bottom 0.254: IC3.25 58.54,56.59 56,59.13 56,64.73 55.8,64.93 53.15,64.93 R5.1 50.62,67.47 U1.6
SDA
  Bottom 0.254: R6.1 51.95,68.73 U1.5 | IC3.26 58.65,57.38 56.6,59.43 56.6,64.93 55.7,65.83 55.5,65.83 55.45,65.88 R6.1 | 54.85,65.93 R6.1
V+  (via drill 0.4)
  Top 0.254: v47.6,54.93 68.4,54.93 v69.1,54.23 | L1.1 30.88,51.13 v40.2,51.13
  Top 0.406: BATT.2 18.1,50.98 C1.+ | C1.+ 23.46,51.12 | L1.1 25.28,49.02 C1.+
  Bottom 0.254: IC3.44 74.34,54.87 73.7,54.23 v69.1,54.23 | v47.6,54.93 42.3,54.93 40.2,52.83 v40.2,51.13

### Text on the board
Top: TOP | Thermometer | 2013 | K-4U
Bottom: BOTTOM | Thermometer | 2013 | K-4U
tNames: TOP | Thermometer | 2013 | K-4U | CONTRAST
bNames: BOTTOM